# EasyEDA schematic sonar_schematic.json
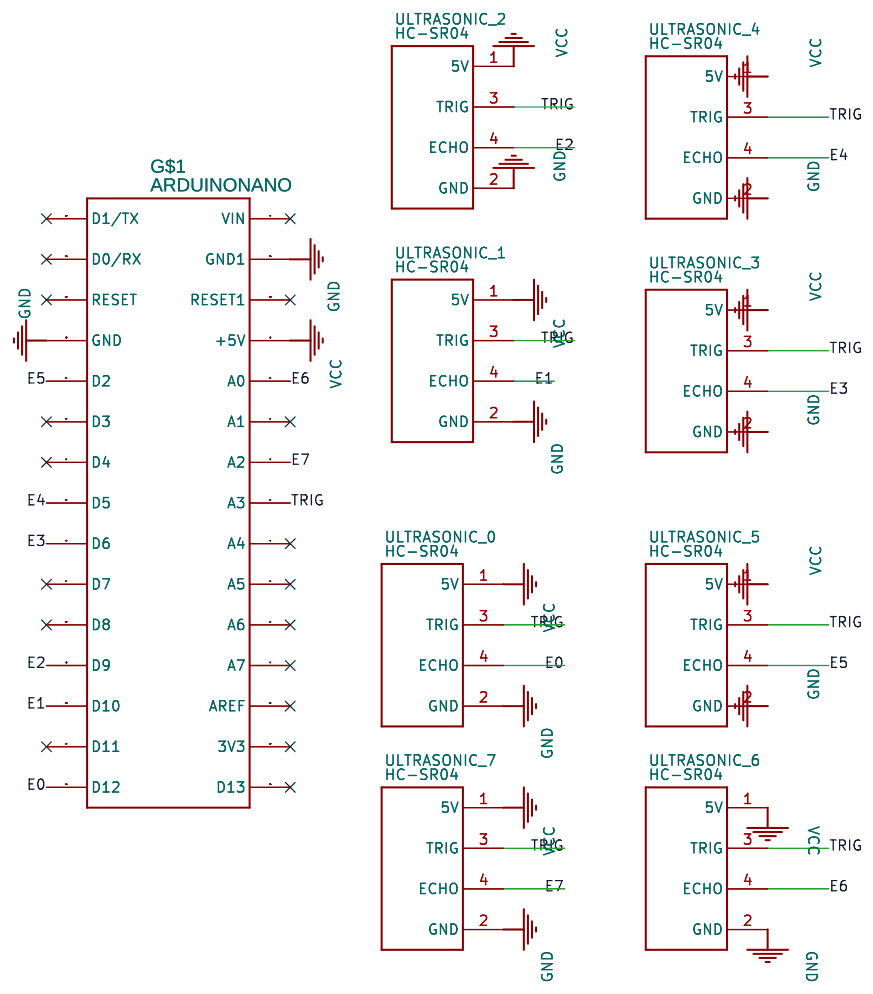
[diagram p0: schematic sheet]

## Parts
G$1  ARDUINONANO  [PDIP-32]
ULTRASONIC_0  HC-SR04  [PINHEADER1X4N]
ULTRASONIC_1  HC-SR04  [PINHEADER1X4N]
ULTRASONIC_2  HC-SR04  [PINHEADER1X4N]
ULTRASONIC_3  HC-SR04  [PINHEADER1X4N]
ULTRASONIC_4  HC-SR04  [PINHEADER1X4N]
ULTRASONIC_5  HC-SR04  [PINHEADER1X4N]
ULTRASONIC_6  HC-SR04  [PINHEADER1X4N]
ULTRASONIC_7  HC-SR04  [PINHEADER1X4N]

## Library data of the parts
G$1 = -: Contributor: Timothé Nilsson (Ichbindiabolik); Manufacturer Part: ?

## Nets
GND: G$1.GND G$1.GND1 ULTRASONIC_0.2(GND) ULTRASONIC_1.2(GND) ULTRASONIC_2.2(GND) ULTRASONIC_3.2(GND) ULTRASONIC_4.2(GND) ULTRASONIC_5.2(GND) ULTRASONIC_6.2(GND) ULTRASONIC_7.2(GND)
VCC: G$1.+5V ULTRASONIC_0.1(5V) ULTRASONIC_1.1(5V) ULTRASONIC_2.1(5V) ULTRASONIC_3.1(5V) ULTRASONIC_4.1(5V) ULTRASONIC_5.1(5V) ULTRASONIC_6.1(5V) ULTRASONIC_7.1(5V)
E0: G$1.D12 ULTRASONIC_0.4(ECHO)
E1: G$1.D10 ULTRASONIC_1.4(ECHO)
E2: G$1.D9 ULTRASONIC_2.4(ECHO)
E3: G$1.D6 ULTRASONIC_3.4(ECHO)
E4: G$1.D5 ULTRASONIC_4.4(ECHO)
E5: G$1.D2 ULTRASONIC_5.4(ECHO)
E6: G$1.A0 ULTRASONIC_6.4(ECHO)
E7: G$1.A2 ULTRASONIC_7.4(ECHO)
TRIG: G$1.A3 ULTRASONIC_0.3(TRIG) ULTRASONIC_1.3(TRIG) ULTRASONIC_2.3(TRIG) ULTRASONIC_3.3(TRIG) ULTRASONIC_4.3(TRIG) ULTRASONIC_5.3(TRIG) ULTRASONIC_6.3(TRIG) ULTRASONIC_7.3(TRIG)

Not connected (* = marked no-connect by the designer): G$1 3V3* A1* A4* A5* A6* A7* AREF* D0/RX* D1/TX* D3* D4* D7* D8* D11* D13* RESET* RESET1* VIN*
